# Altium schematic sheet WIFI.SchDoc
size B
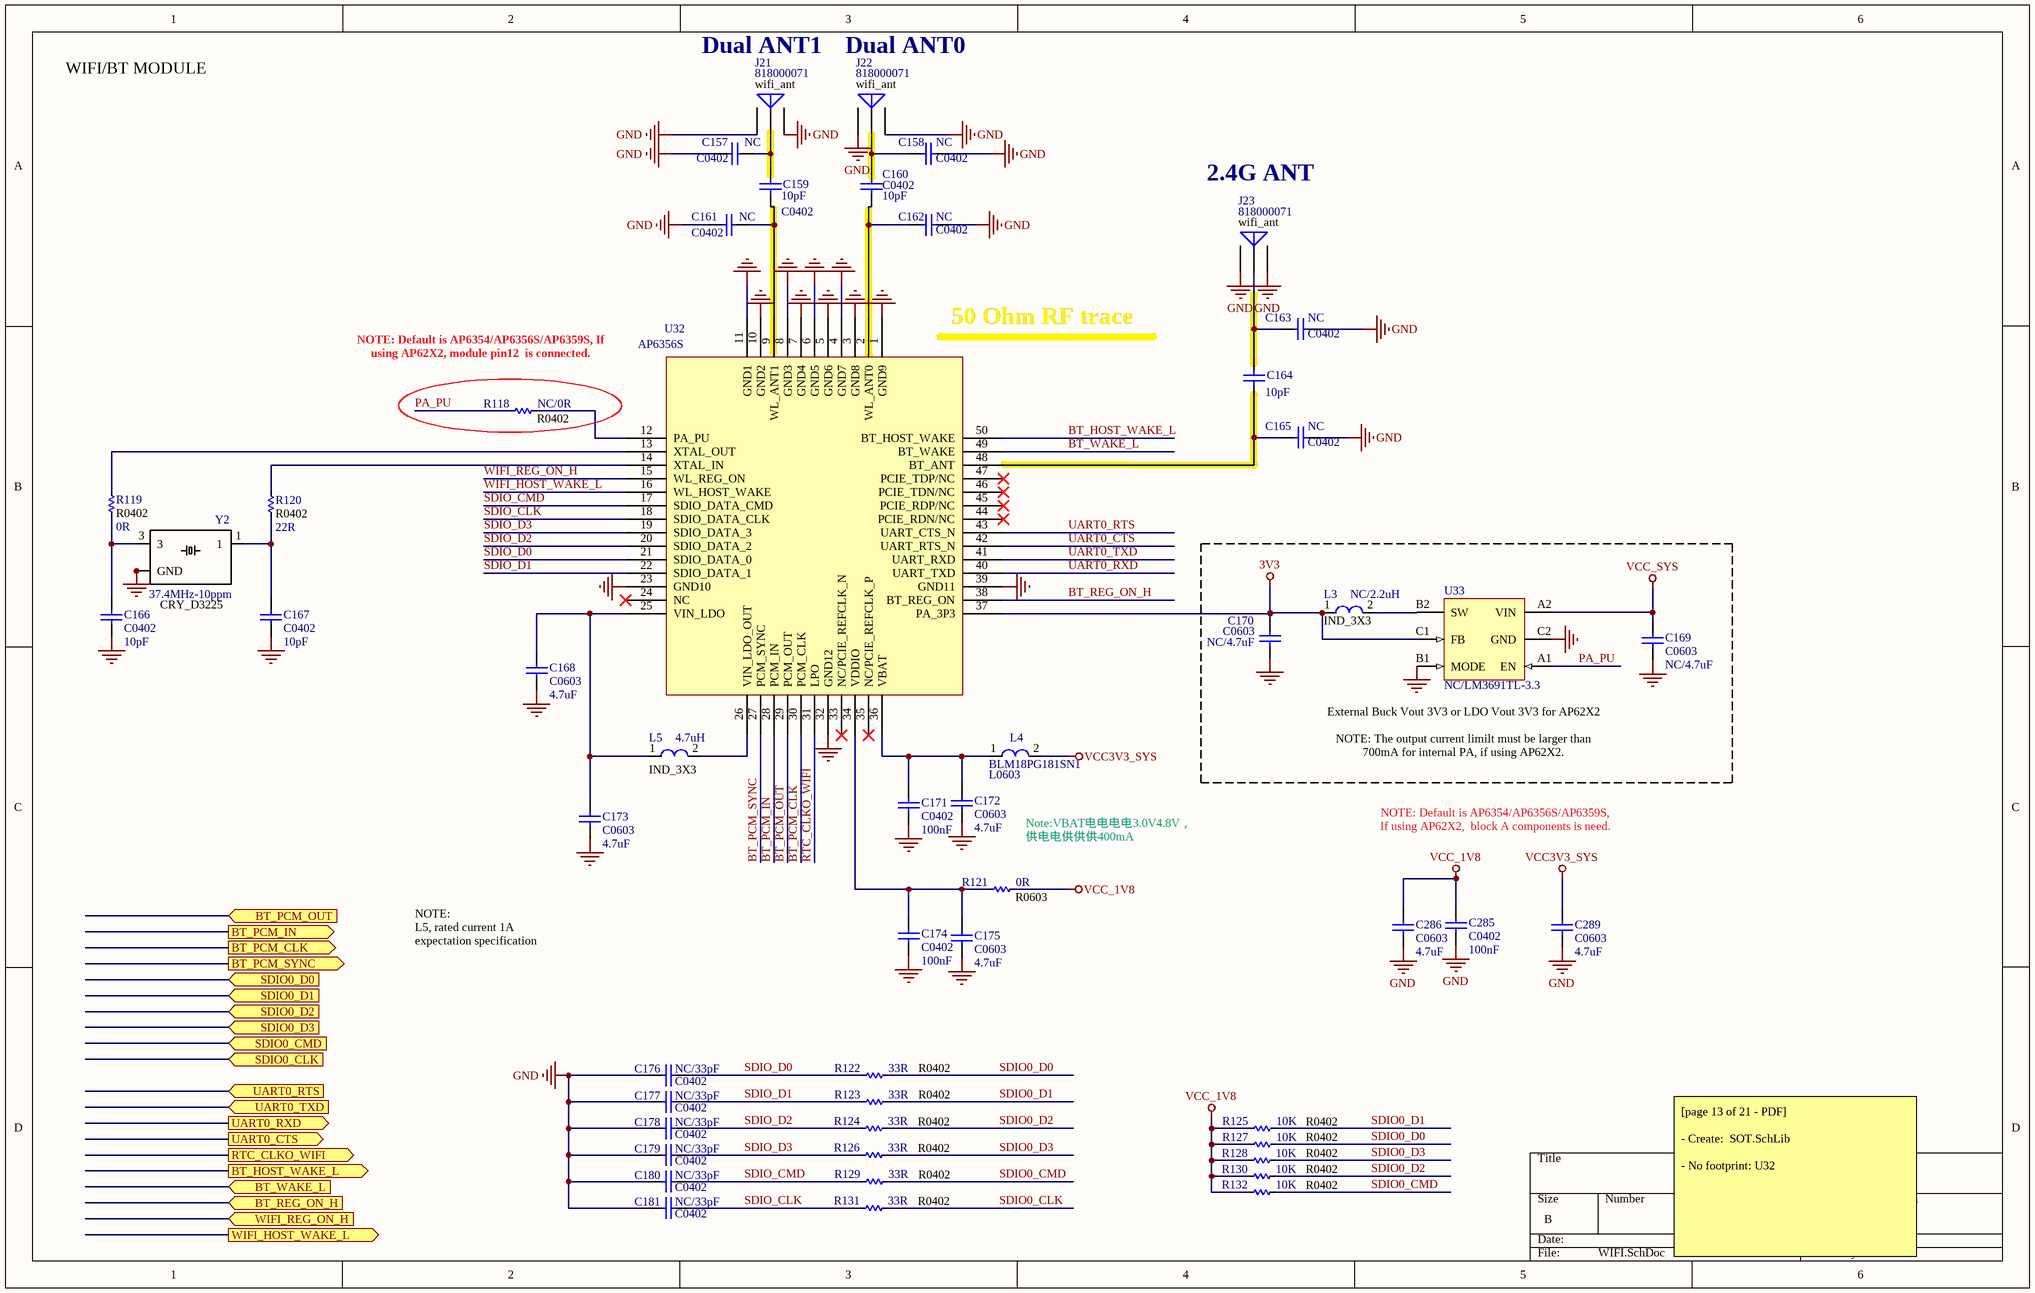
[diagram p0: WIFI.SchDoc]

## Parts
C157  C0402  value NC  [C 0402]
C158  C0402  value NC  [C 0402]
C159  C0402  value 10pF  [C 0402]
C160  C0402  value 10pF  [C 0402]
C161  C0402  value NC  [C 0402]
C162  C0402  value NC  [C 0402]
C163  C0402  value NC  [C 0402]
C164  value 10pF  [C 0402]  (hidden comment: C0402)
C165  C0402  value NC  [C 0402]
C166  C0402  value 10pF  [C 0402]
C167  C0402  value 10pF  [C 0402]
C168  C0603  value 4.7uF  [C 0603]
C169  C0603  value NC/4.7uF  [C 0603]
C170  C0603  value NC/4.7uF  [C 0603]
C171  C0402  value 100nF  [C 0402]
C172  C0603  value 4.7uF  [C 0603]
C173  C0603  value 4.7uF  [C 0603]
C174  C0402  value 100nF  [C 0402]
C175  C0603  value 4.7uF  [C 0603]
C176  C0402  value NC/33pF  [C 0402]
C177  C0402  value NC/33pF  [C 0402]
C178  C0402  value NC/33pF  [C 0402]
C179  C0402  value NC/33pF  [C 0402]
C180  C0402  value NC/33pF  [C 0402]
C181  C0402  value NC/33pF  [C 0402]
C285  C0402  value 100nF  [C 0402]
C286  C0603  value 4.7uF  [C 0603]
C289  C0603  value 4.7uF  [C 0603]
J21  818000071  [CONN/IPX/SMD]
J22  818000071  [CONN/IPX/SMD]
J23  818000071  [CONN/IPX/SMD]
L3  NC/2.2uH  [L-SMD-M-7.3x4.5]
L4  L0603  [L-SMD-M-12x10]
L5  4.7uH  [L-SMD-M-7.3x4.5]
R118  R0402  value NC/0R  [R 0402]
R119  R0402  value 0R  [R 0402]
R120  R0402  value 22R  [R 0402]
R121  R0603  value 0R  [R 0603]
R122  R0402  value 33R  [R 0402]
R123  R0402  value 33R  [R 0402]
R124  R0402  value 33R  [R 0402]
R125  R0402  value 10K  [R 0402]
R126  R0402  value 33R  [R 0402]
R127  R0402  value 10K  [R 0402]
R128  R0402  value 10K  [R 0402]
R129  R0402  value 33R  [R 0402]
R130  R0402  value 10K  [R 0402]
R131  R0402  value 33R  [R 0402]
R132  R0402  value 10K  [R 0402]
U32  AP6356S  [AP6356S]
U33  NC/LM3691TL-3.3  [TLA06LCA]
Y2  37.4MHz-10ppm  [Crystal 4-SMD 32x25]

## Ports
BT_HOST_WAKE_L (out), BT_PCM_CLK (out), BT_PCM_IN (out), BT_PCM_OUT (in), BT_PCM_SYNC (out), BT_REG_ON_H (in), BT_WAKE_L (in), RTC_CLKO_WIFI (out), SDIO0_CLK (in), SDIO0_CMD (in), SDIO0_D0 (in), SDIO0_D1 (in), SDIO0_D2 (in), SDIO0_D3 (in), UART0_CTS (out), UART0_RTS (in), UART0_RXD (out), UART0_TXD (in), WIFI_HOST_WAKE_L (out), WIFI_REG_ON_H (in)

## Nets
3V3: C170.2 L3.1 U32.37(PA_3P3) U33.C1(FB)
GND: C157.2 C158.2 C161.2 C162.2 C163.2 C165.2 C166.1 C167.1 C168.1 C169.1 C170.1 C171.1 C172.1 C173.1 C174.1 C175.1 C176.1 C177.1 C178.1 C179.1 C180.1 C181.1 C285.1 C286.1 C289.1 J21.2 J21.3 J22.2 J22.3 J23.2 J23.3 U32.1(GND9) U32.3(GND8) U32.4(GND7) U32.5(GND6) U32.6(GND5) U32.7(GND4) U32.8(GND3) U32.10(GND2) U32.11(GND1) U32.23(GND10) U32.32(GND12) U32.39(GND11) U33.B1(MODE) U33.C2(GND) Y2.2(GND) Y2.4(GND)
VCC3V3_SYS: C289.2 L4.2
VCC_1V8: C285.2 C286.2 R121.2 R125.1 R127.1 R128.1 R130.1 R132.1
VCC_SYS: C169.2 U33.A2(VIN)
BT_HOST_WAKE_L: U32.50(BT_HOST_WAKE)
BT_PCM_CLK: U32.30(PCM_CLK)
BT_PCM_IN: U32.28(PCM_IN)
BT_PCM_OUT: U32.29(PCM_OUT)
BT_PCM_SYNC: U32.27(PCM_SYNC)
BT_REG_ON_H: U32.38(BT_REG_ON)
BT_WAKE_L: U32.49(BT_WAKE)
PA_PU: R118.1 U33.A1(EN)
RTC_CLKO_WIFI: U32.31(LPO)
SDIO0_CLK: R131.2
SDIO0_CMD: R129.2 R132.2
SDIO0_D0: R122.2 R127.2
SDIO0_D1: R123.2 R125.2
SDIO0_D2: R124.2 R130.2
SDIO0_D3: R126.2 R128.2
SDIO_CLK: C181.2 R131.1 U32.18(SDIO_DATA_CLK)
SDIO_CMD: C180.2 R129.1 U32.17(SDIO_DATA_CMD)
SDIO_D0: C176.2 R122.1 U32.21(SDIO_DATA_0)
SDIO_D1: C177.2 R123.1 U32.22(SDIO_DATA_1)
SDIO_D2: C178.2 R124.1 U32.20(SDIO_DATA_2)
SDIO_D3: C179.2 R126.1 U32.19(SDIO_DATA_3)
UART0_CTS: U32.42(UART_RTS_N)
UART0_RTS: U32.43(UART_CTS_N)
UART0_RXD: U32.40(UART_TXD)
UART0_TXD: U32.41(UART_RXD)
WIFI_HOST_WAKE_L: U32.16(WL_HOST_WAKE)
WIFI_REG_ON_H: U32.15(WL_REG_ON)
NetC157_1: C157.1 C159.1 J21.1(A)
NetC158_1: C158.1 C160.1 J22.1(A)
NetC159_2: C159.2 C161.1 U32.9(WL_ANT1)
NetC160_2: C160.2 C162.1 U32.2(WL_ANT0)
NetC163_1: C163.1 C164.1 J23.1(A)
NetC164_2: C164.2 C165.1 U32.48(BT_ANT)
NetC166_2: C166.2 R119.1 Y2.3
NetC167_2: C167.2 R120.1 Y2.1
NetC168_2: C168.2 C173.2 L5.1 U32.25(VIN_LDO)
NetC171_2: C171.2 C172.2 L4.1 U32.36(VBAT)
NetC174_2: C174.2 C175.2 R121.1 U32.34(VDDIO)
NetL3_2: L3.2 U33.B2(SW)
NetL5_2: L5.2 U32.26(VIN_LDO_OUT)
NetR118_2: R118.2 U32.12(PA_PU)
NetR119_2: R119.2 U32.13(XTAL_OUT)
NetR120_2: R120.2 U32.14(XTAL_IN)

Not connected (* = marked no-connect by the designer): U32 24(NC)* 33(NC/PCIE_REFCLK_N)* 35(NC/PCIE_REFCLK_P)* 44(PCIE_RDN/NC)* 45(PCIE_RDP/NC)* 46(PCIE_TDN/NC)* 47(PCIE_TDP/NC)*

## Notes on the sheet
- WIFI/BT MODULE
- Dual ANT1
- (near J22) Dual ANT0
- 2.4G ANT
- NOTE: Default is AP6354/AP6356S/AP6359S, If using AP62X2, module pin12  is connected.
- (near U32) 50 Ohm RF trace
- (near U33) External Buck Vout 3V3 or LDO Vout 3V3 for AP62X2
  NOTE: The output current limilt must be larger than 700mA for internal PA, if using AP62X2.
- Note:VBAT电电电电3.0V4.8V，     供电电供供供400mA
- NOTE: Default is AP6354/AP6356S/AP6359S, If using AP62X2,  block A components is need.
- NOTE:
  L5, rated current 1A
  expectation specification
- [page 13 of 21 - PDF]
  - Create:  SOT.SchLib
  - No footprint: U32
- (in symbol ABM8-30.000MHZ-10-1-U-T) CRY_D3225
- (in symbol Antenna) wifi_ant
- (in symbol L-SMD-1) IND_3X3; BLM18PG181SN1

## Library data of the parts
C157-C181 C285 C286 C289 = Cap: Capacitor; Published: 8-Jun-2000; LatestRevisionDate: 17-Jul-2002; LatestRevisionNote: Re-released for DXP Platform.; PackageReference: RAD-0.3; Publisher: Altium Limited; PackageDescription: Radial Cap, Thru-Hole; 2 Leads; 0.3 in Pin Spacing
J21-J23 = Antenna: Generic Antenna; Published: 24-Mar-1999; LatestRevisionDate: 17-Jul-2002; LatestRevisionNote: Re-released for DXP Platform.; PackageReference: PIN1; Publisher: Altium Limited
L3-L5 = L-SMD-1: partNo: 78477010; Manufacturer: Wurth Elektronik; Inductance: 1.0 μH; ComponentLink1Description: Manufacturer; ComponentLink1URL: http://www.we-online.de; Created by: Baojun Chen; Created Date: Nov.2015; ComponentLink2Description: Datasheet; ComponentLink2URL: http://katalog.we-online.de/pbs/datasheet/78477010.pdf
R118-R132 = Res-SMD: Resistor; Manufacturer: Generic Components; Class: Passive; Published: 08/06/2000; Publisher: Altium Hobart Technology Centre
U33 = LM3691TL-3.3/NOPB: High Accuracy, Miniature 1A, Step-Down DC-DC Converter for Portable Applications, 6-pin Micro SMD, 250 Reel; Manufacturer: National Semiconductor; PackageTopMarking: XV*I T; PowerWise: N; CompType: MiscPower; High-Reliability: Y; DatasheetVersion: Jan-2011; PackageVersion: revC, Jan-2004; PackageReference: TLA06LCA; PackageDescription: Thin Micro SMD, 6 Bump (Large), 0.5mm Pitch; PartNumber: LM3691TL-3.3/NOPB; RoHS: Y; PinCount: 6; Code_JEDEC: MO-211-DB; ComponentLink1Description: Manufacturer URL; ComponentLink1URL: http://www.national.com/; ComponentLink2Description: LM3691 Datasheet; ComponentLink2URL: http://www.national.com/ds/LM/LM3691.pdf; ComponentLink3Description: LM3691 Web Page; ComponentLink3URL: http://www.national.com/pf/LM/LM3691.html; ComponentLink4Description: TLA06LCA Package Page; ComponentLink4URL: http://www.national.com/packaging/folders/tla06lca.html
Y2 = ABM8-30.000MHZ-10-1-U-T: Ultra Miniature Crystal, SMD Ceramic, 30.000MHZ, 10pF, 10ppm@25C, 10ppm -10+60C,; MF: Abracon; SnapEDA_Link: https://www.snapeda.com/parts/ABM8-30.000MHZ-10-1-U-T/Abracon%20LLC/view-part/?ref=snap; MP: ABM8-30.000MHZ-10-1-U-T; Availability: Unavailable; Price: None; Package: SMD-4 Abracon; Value: *